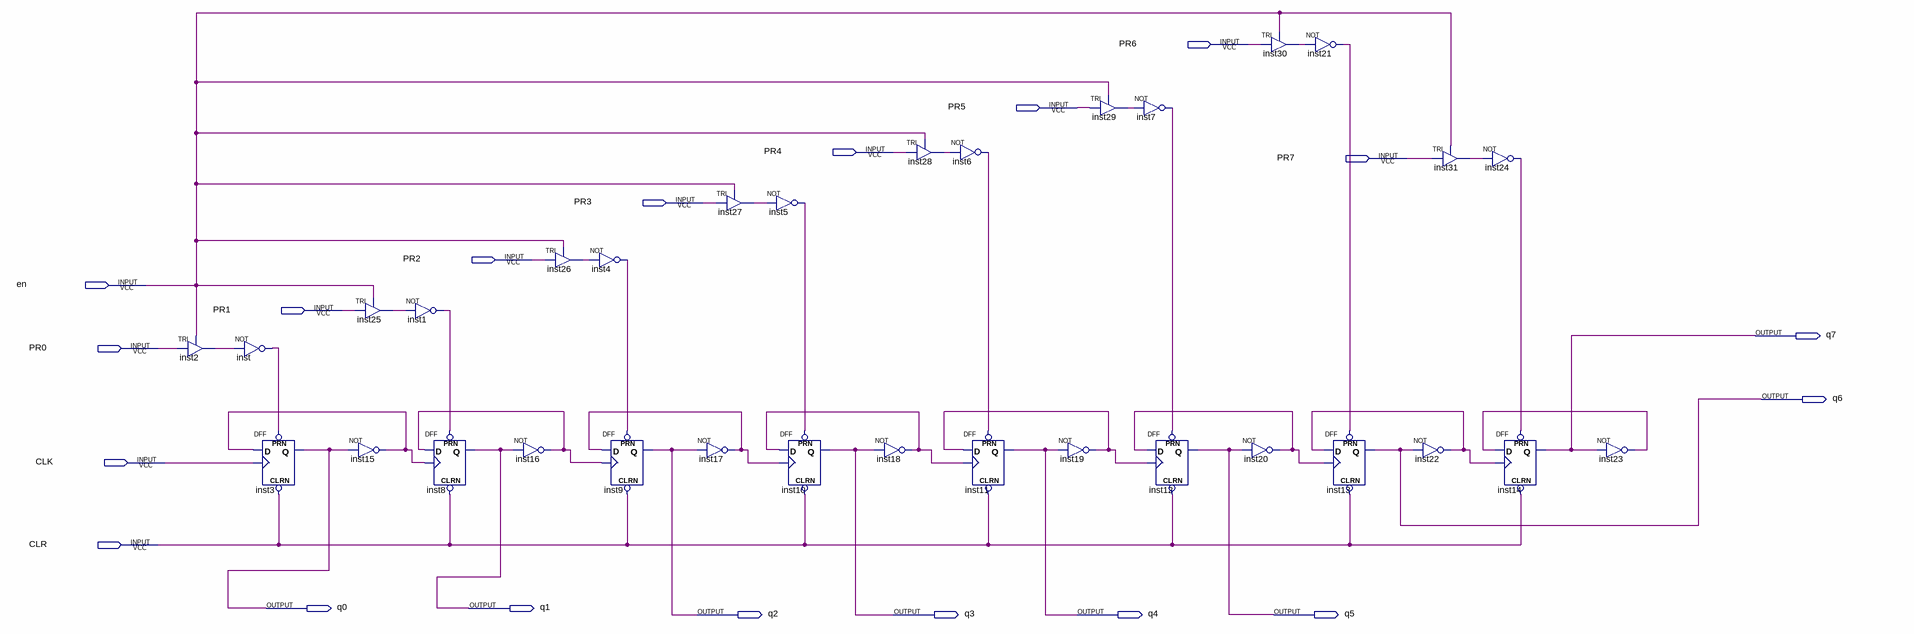
[diagram p0: schematic sheet]
// Quartus schematic couter-with-pr.bdf as structural Verilog: 32 symbols, 19 pins
module \couter-with-pr  (
  input  PR6,
  input  PR5,
  input  PR4,
  input  PR7,
  input  PR3,
  input  PR2,
  input  en,
  input  PR1,
  input  PR0,
  input  CLK,
  input  CLR,
  output q7,
  output q6,
  output q0,
  output q1,
  output q2,
  output q3,
  output q4,
  output q5
);

  wire inst1_out, inst2_out, inst4_out, inst5_out, inst6_out, inst7_out, inst15_out, inst16_out, inst17_out,
       inst18_out, inst19_out, inst20_out, inst21_out, inst22_out, inst23_out, inst24_out, inst25_out,
       inst26_out, inst27_out, inst28_out, inst29_out, inst30_out, inst31_out, inst_out;

  TRI inst2 (.IN(PR0), .OE(en), .OUT(inst2_out));
  not inst (inst_out, inst2_out);
  DFF inst3 (.CLRN(CLR), .CLK(CLK), .D(inst15_out), .PRN(inst_out), .Q(q0));
  not inst15 (inst15_out, q0);
  TRI inst25 (.IN(PR1), .OE(en), .OUT(inst25_out));
  not inst1 (inst1_out, inst25_out);
  DFF inst8 (.CLRN(CLR), .CLK(inst15_out), .D(inst16_out), .PRN(inst1_out), .Q(q1));
  TRI inst26 (.IN(PR2), .OE(en), .OUT(inst26_out));
  not inst16 (inst16_out, q1);
  not inst4 (inst4_out, inst26_out);
  DFF inst9 (.CLRN(CLR), .CLK(inst16_out), .D(inst17_out), .PRN(inst4_out), .Q(q2));
  not inst17 (inst17_out, q2);
  TRI inst27 (.IN(PR3), .OE(en), .OUT(inst27_out));
  not inst5 (inst5_out, inst27_out);
  DFF inst10 (.CLRN(CLR), .CLK(inst17_out), .D(inst18_out), .PRN(inst5_out), .Q(q3));
  TRI inst28 (.IN(PR4), .OE(en), .OUT(inst28_out));
  not inst18 (inst18_out, q3);
  not inst6 (inst6_out, inst28_out);
  DFF inst11 (.CLRN(CLR), .CLK(inst18_out), .D(inst19_out), .PRN(inst6_out), .Q(q4));
  not inst19 (inst19_out, q4);
  TRI inst29 (.IN(PR5), .OE(en), .OUT(inst29_out));
  not inst7 (inst7_out, inst29_out);
  DFF inst12 (.CLRN(CLR), .CLK(inst19_out), .D(inst20_out), .PRN(inst7_out), .Q(q5));
  TRI inst30 (.IN(PR6), .OE(en), .OUT(inst30_out));
  not inst20 (inst20_out, q5);
  not inst21 (inst21_out, inst30_out);
  DFF inst13 (.CLRN(CLR), .CLK(inst20_out), .D(inst22_out), .PRN(inst21_out), .Q(q6));
  not inst22 (inst22_out, q6);
  TRI inst31 (.IN(PR7), .OE(en), .OUT(inst31_out));
  not inst24 (inst24_out, inst31_out);
  DFF inst14 (.CLRN(CLR), .CLK(inst22_out), .D(inst23_out), .PRN(inst24_out), .Q(q7));
  not inst23 (inst23_out, q7);
endmodule
